# Altium schematic sheet lora.SchDoc
size A4
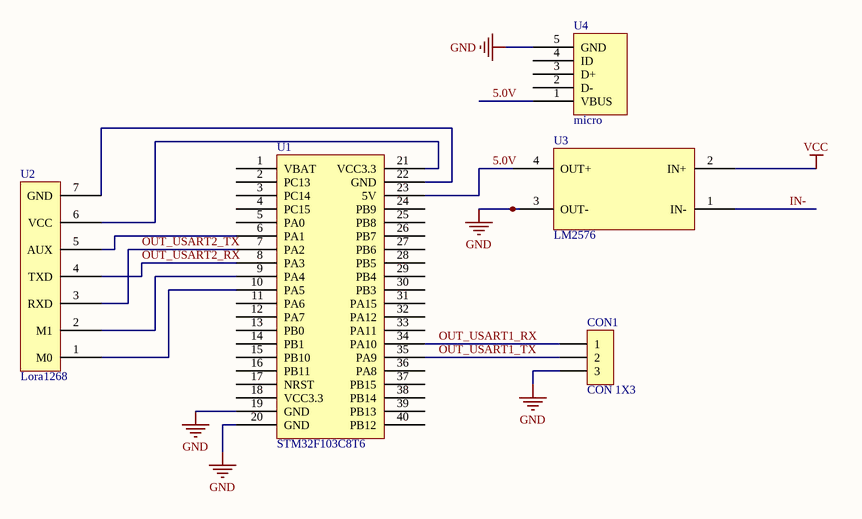
[diagram p0: lora.SchDoc]

## Parts
CON1  CON 1X3  [CON 1X3]
U1  STM32F103C8T6  [STM32C8T6]
U2  Lora1268  [Lora模块]
U3  LM2576  [LM2576]
U4  micro  [micro]

## Nets
GND: CON1.3 U1.19(GND) U1.20(GND) U3.3(OUT-) U4.5(GND)
VCC: U3.2(IN+)
5.0V: U1.23(5V) U3.4(OUT+) U4.1(VBUS)
IN-: U3.1(IN-)
OUT_USART1_RX: CON1.1 U1.34(PA10)
OUT_USART1_TX: CON1.2 U1.35(PA9)
OUT_USART2_RX: U1.8(PA3) U2.4(TXD)
OUT_USART2_TX: U1.7(PA2) U2.3(RXD)
NetU1_6: U1.6(PA1) U2.5(AUX)
NetU1_9: U1.9(PA4) U2.2(M1)
NetU1_10: U1.10(PA5) U2.1(M0)
NetU1_21: U1.21(VCC3.3) U2.6(VCC)
NetU1_22: U1.22(GND) U2.7(GND)

Not connected (* = marked no-connect by the designer): U1 1(VBAT) 2(PC13) 3(PC14) 4(PC15) 5(PA0) 11(PA6) 12(PA7) 13(PB0) 14(PB1) 15(PB10) 16(PB11) 17(NRST) 18(VCC3.3) 24(PB9) 25(PB8) 26(PB7) 27(PB6) 28(PB5) 29(PB4) 30(PB3) 31(PA15) 32(PA12) 33(PA11) 36(PA8) 37(PB15) 38(PB14) 39(PB13) 40(PB12); U4 2(D-) 3(D+) 4(ID)

## Library data of the parts
CON1 = CON 1X3: 单排排针
U1 = STM32C8T6